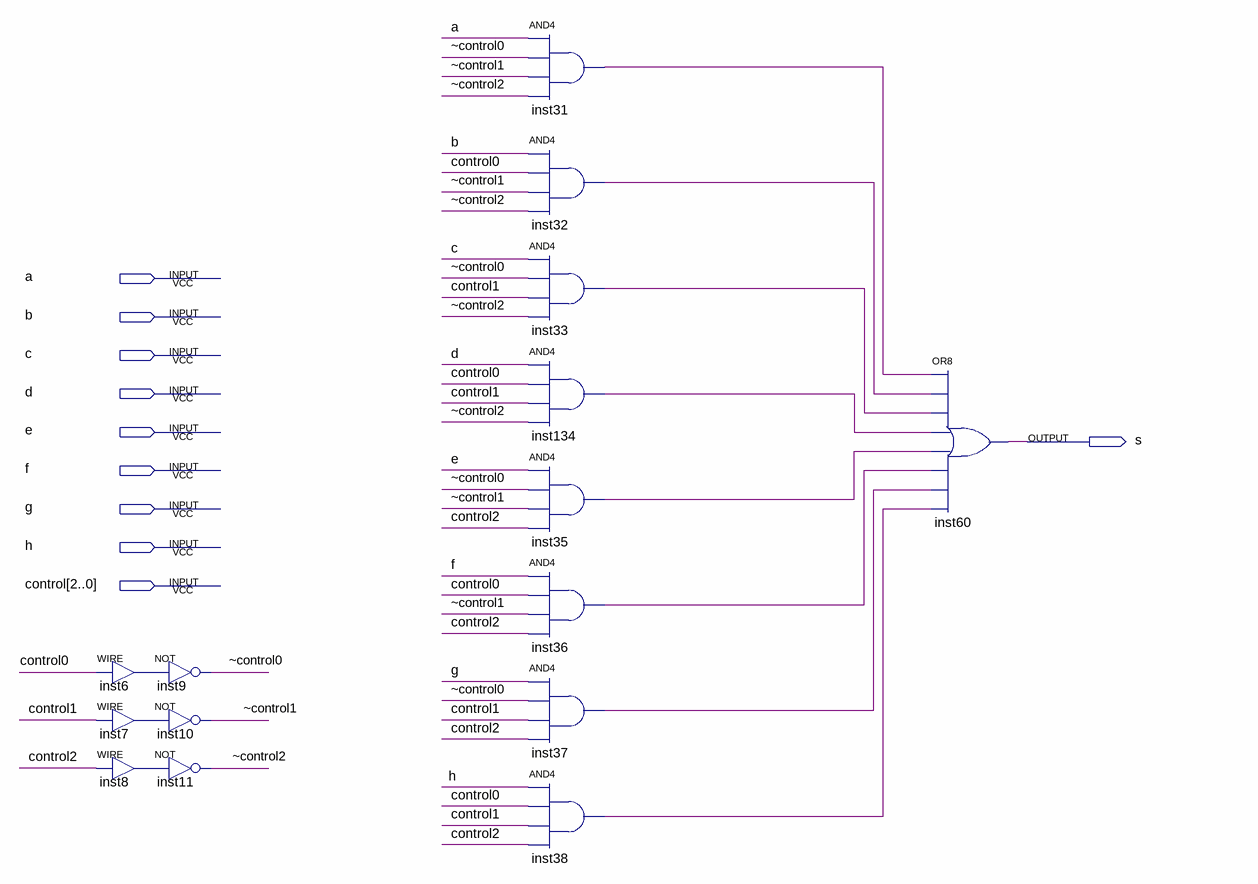
[diagram p0: schematic sheet]
// Quartus schematic mux8x1.bdf as structural Verilog: 15 symbols, 10 pins
module mux8x1 (
  input  a,
  input  b,
  input  c,
  input  d,
  input  e,
  input  f,
  input  g,
  input  h,
  input  [2:0] control,
  output s
);

  wire inst6_out, inst7_out, inst8_out, inst31_out, inst32_out, inst33_out, inst35_out, inst36_out,
       inst37_out, inst38_out, inst134_out, \~control0 , \~control1 , \~control2 ;

  assign inst6_out = control[0];  // WIRE inst6
  not inst9 (\~control0 , inst6_out);
  assign inst7_out = control[1];  // WIRE inst7
  not inst10 (\~control1 , inst7_out);
  assign inst8_out = control[2];  // WIRE inst8
  not inst11 (\~control2 , inst8_out);
  and inst31 (inst31_out, a, \~control0 , \~control1 , \~control2 );
  and inst32 (inst32_out, b, control[0], \~control1 , \~control2 );
  and inst33 (inst33_out, c, \~control0 , control[1], \~control2 );
  and inst134 (inst134_out, d, control[0], control[1], \~control2 );
  and inst35 (inst35_out, e, \~control0 , \~control1 , control[2]);
  and inst36 (inst36_out, f, control[0], \~control1 , control[2]);
  and inst37 (inst37_out, g, \~control0 , control[1], control[2]);
  and inst38 (inst38_out, h, control[0], control[1], control[2]);
  or inst60 (s, inst31_out, inst32_out, inst33_out, inst134_out, inst35_out, inst36_out, inst37_out, inst38_out);
endmodule
